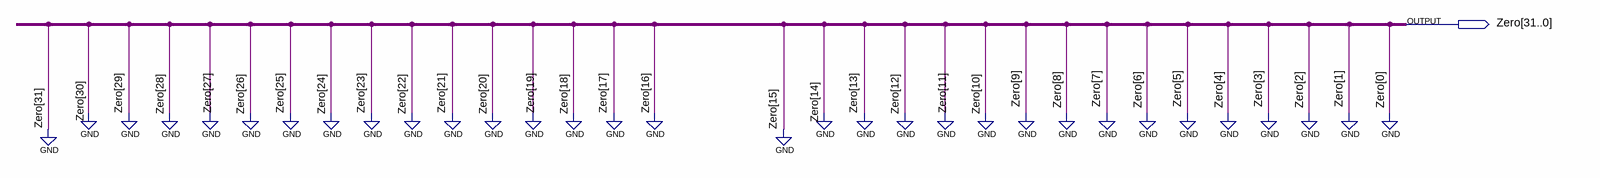
[diagram p0: schematic sheet]
// Quartus schematic Zero_32.bdf as structural Verilog: 0 symbols, 1 pins
module Zero_32 (
  output [31:0] Zero
);


  assign Zero = {32{1'b0}};
endmodule
